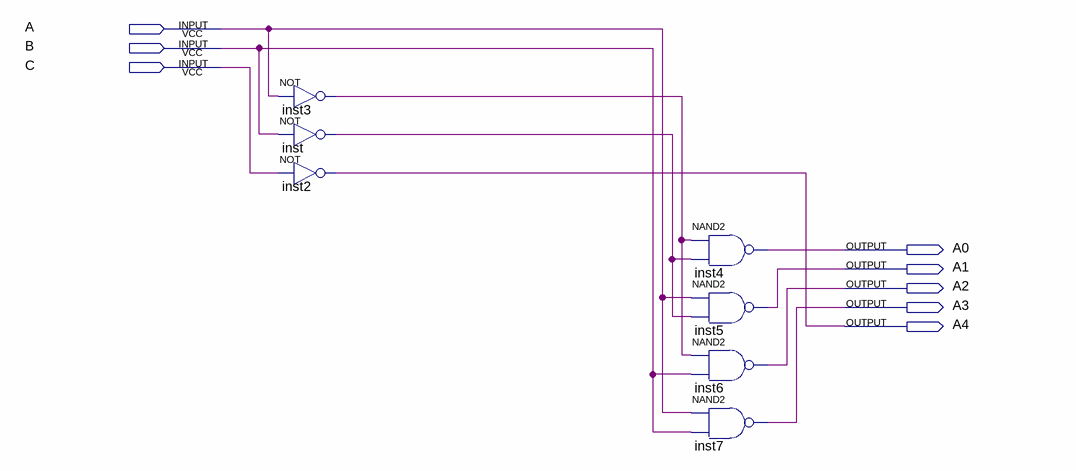
[diagram p0: schematic sheet]
// Quartus schematic DECODER.bdf as structural Verilog: 7 symbols, 8 pins
module DECODER (
  input  A,
  input  B,
  input  C,
  output A0,
  output A1,
  output A2,
  output A3,
  output A4
);

  wire inst3_out, inst_out;

  not inst3 (inst3_out, A);
  not inst (inst_out, B);
  not inst2 (A4, C);
  nand inst4 (A0, inst3_out, inst_out);
  nand inst5 (A1, A, inst_out);
  nand inst6 (A2, inst3_out, B);
  nand inst7 (A3, A, B);
endmodule
